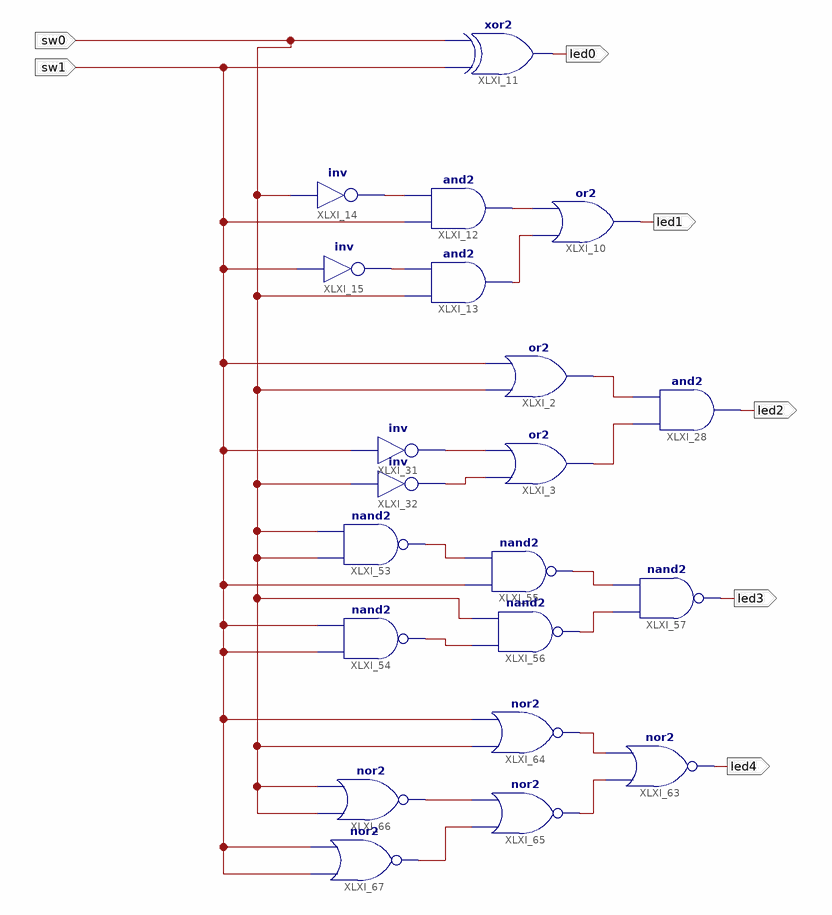
[diagram p0: schematic sheet 1]
// Xilinx ISE schematic lab4_1.sch (spartan3e) as structural Verilog: 21 symbols, 7 ports
module lab4_1 (
  input  sw0,
  input  sw1,
  output led1,
  output led2,
  output led3,
  output led4,
  output led0
);

  wire XLXN_3, XLXN_4, XLXN_5, XLXN_6, XLXN_25, XLXN_26, XLXN_27, XLXN_28, XLXN_32, XLXN_33, XLXN_34,
       XLXN_35, XLXN_42, XLXN_43, XLXN_44, XLXN_45;

  or XLXI_10 (led1, XLXN_6, XLXN_5);
  and XLXI_12 (XLXN_5, sw1, XLXN_3);
  and XLXI_13 (XLXN_6, sw0, XLXN_4);
  not XLXI_14 (XLXN_3, sw0);
  not XLXI_15 (XLXN_4, sw1);
  not XLXI_32 (XLXN_28, sw0);
  not XLXI_31 (XLXN_27, sw1);
  and XLXI_28 (led2, XLXN_26, XLXN_25);
  or XLXI_3 (XLXN_26, XLXN_28, XLXN_27);
  or XLXI_2 (XLXN_25, sw0, sw1);
  nand XLXI_53 (XLXN_34, sw0, sw0);
  nand XLXI_54 (XLXN_35, sw1, sw1);
  nand XLXI_55 (XLXN_32, sw1, XLXN_34);
  nand XLXI_56 (XLXN_33, XLXN_35, sw0);
  nand XLXI_57 (led3, XLXN_33, XLXN_32);
  nor XLXI_63 (led4, XLXN_43, XLXN_42);
  nor XLXI_64 (XLXN_42, sw0, sw1);
  nor XLXI_65 (XLXN_43, XLXN_45, XLXN_44);
  nor XLXI_66 (XLXN_44, sw0, sw0);
  nor XLXI_67 (XLXN_45, sw1, sw1);
  xor XLXI_11 (led0, sw1, sw0);
endmodule
